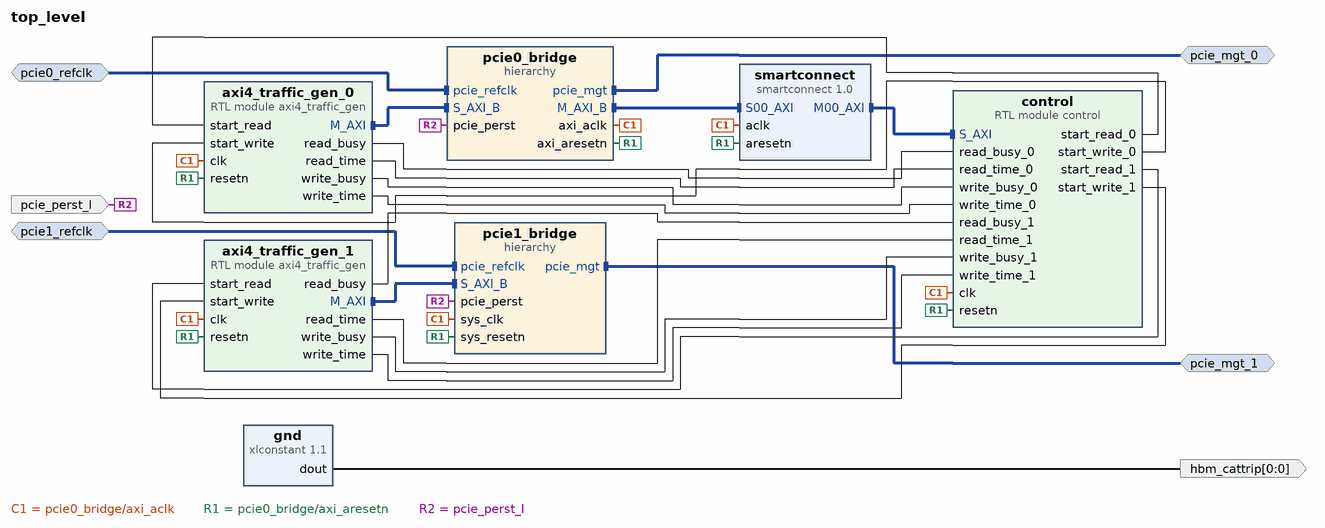
[diagram p0: block diagram of the top level]
# Vivado block design top_level, xcu55c-fsvh2892-2L-e, Vivado 2021.1
create_bd_design top_level

create_bd_intf_port -mode Slave -vlnv xilinx.com:interface:diff_clock_rtl:1.0 pcie0_refclk
create_bd_intf_port -mode Master -vlnv xilinx.com:interface:pcie_7x_mgt_rtl:1.0 pcie_mgt_0
create_bd_intf_port -mode Slave -vlnv xilinx.com:interface:diff_clock_rtl:1.0 pcie1_refclk
create_bd_intf_port -mode Master -vlnv xilinx.com:interface:pcie_7x_mgt_rtl:1.0 pcie_mgt_1
create_bd_port -dir O -from 0 -to 0 hbm_cattrip
create_bd_port -dir I -type rst pcie_perst_l

create_bd_cell -type hier pcie0_bridge
create_bd_cell -type ip -vlnv xilinx.com:ip:smartconnect:1.0 smartconnect
set_property -dict {CONFIG.NUM_SI 1} [get_bd_cells smartconnect]
create_bd_cell -type ip -vlnv xilinx.com:ip:xlconstant:1.1 gnd
set_property -dict {CONFIG.CONST_VAL 0} [get_bd_cells gnd]
create_bd_cell -type module -reference control control
create_bd_cell -type module -reference axi4_traffic_gen axi4_traffic_gen_0
set_property -dict {CONFIG.PCI_BASE_ADDR 0x0000000100000000} [get_bd_cells axi4_traffic_gen_0]
create_bd_cell -type module -reference axi4_traffic_gen axi4_traffic_gen_1
set_property -dict {CONFIG.PCI_BASE_ADDR 0x0000000200000000} [get_bd_cells axi4_traffic_gen_1]
create_bd_cell -type hier pcie1_bridge

# ---- hierarchy /pcie0_bridge ----
current_bd_instance /pcie0_bridge
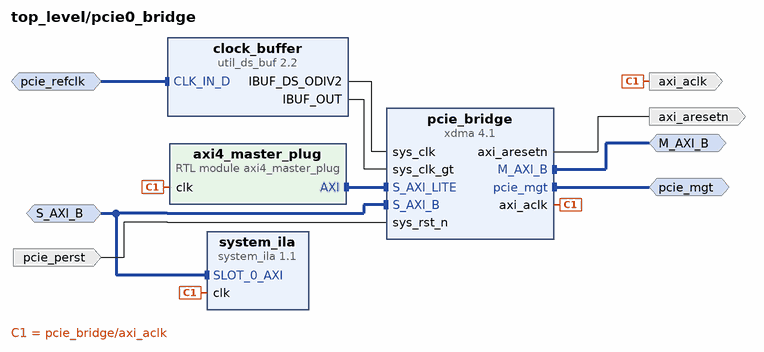
[diagram p1: block diagram inside /pcie0_bridge]
create_bd_intf_pin -mode Master -vlnv xilinx.com:interface:pcie_7x_mgt_rtl:1.0 pcie_mgt
create_bd_intf_pin -mode Slave -vlnv xilinx.com:interface:diff_clock_rtl:1.0 pcie_refclk
create_bd_intf_pin -mode Master -vlnv xilinx.com:interface:aximm_rtl:1.0 M_AXI_B
create_bd_intf_pin -mode Slave -vlnv xilinx.com:interface:aximm_rtl:1.0 S_AXI_B
create_bd_pin -dir I -type rst pcie_perst
create_bd_pin -dir O axi_aclk
create_bd_pin -dir O axi_aresetn

create_bd_cell -type ip -vlnv xilinx.com:ip:xdma:4.1 pcie_bridge
set_property -dict [list \
  CONFIG.PF0_DEVICE_ID_mqdma 9048 \
  CONFIG.PF0_SRIOV_VF_DEVICE_ID A048 \
  CONFIG.PF2_DEVICE_ID_mqdma 9248 \
  CONFIG.PF3_DEVICE_ID_mqdma 9348 \
  CONFIG.axi_addr_width 64 \
  CONFIG.axi_data_width 512_bit \
  CONFIG.axisten_freq 250 \
  CONFIG.bridge_burst true \
  CONFIG.en_axi_slave_if true \
  CONFIG.en_gt_selection true \
  CONFIG.functional_mode AXI_Bridge \
  CONFIG.mode_selection Advanced \
  CONFIG.pcie_blk_locn PCIE4C_X1Y1 \
  CONFIG.pf0_bar0_scale Megabytes \
  CONFIG.pf0_bar0_size 1 \
  CONFIG.pf0_device_id 903f \
  CONFIG.pf0_msi_enabled false \
  CONFIG.pl_link_cap_max_link_speed 16.0_GT/s \
  CONFIG.pl_link_cap_max_link_width X8 \
  CONFIG.select_quad GTY_Quad_227 \
] [get_bd_cells pcie_bridge]
create_bd_cell -type ip -vlnv xilinx.com:ip:util_ds_buf:2.2 clock_buffer
set_property -dict {CONFIG.C_BUF_TYPE IBUFDSGTE} [get_bd_cells clock_buffer]
create_bd_cell -type ip -vlnv xilinx.com:ip:system_ila:1.1 system_ila
create_bd_cell -type module -reference axi4_master_plug axi4_master_plug

# ---- hierarchy /pcie1_bridge ----
current_bd_instance /pcie1_bridge
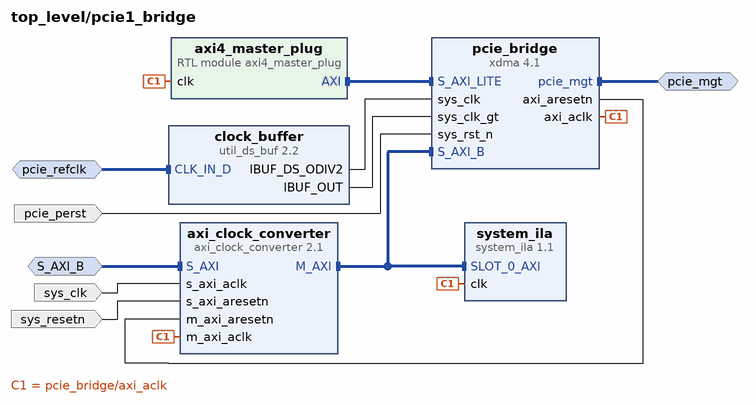
[diagram p2: block diagram inside /pcie1_bridge]
create_bd_intf_pin -mode Master -vlnv xilinx.com:interface:pcie_7x_mgt_rtl:1.0 pcie_mgt
create_bd_intf_pin -mode Slave -vlnv xilinx.com:interface:diff_clock_rtl:1.0 pcie_refclk
create_bd_intf_pin -mode Slave -vlnv xilinx.com:interface:aximm_rtl:1.0 S_AXI_B
create_bd_pin -dir I -type rst pcie_perst
create_bd_pin -dir I sys_clk
create_bd_pin -dir I sys_resetn

create_bd_cell -type ip -vlnv xilinx.com:ip:xdma:4.1 pcie_bridge
set_property -dict [list \
  CONFIG.PF0_DEVICE_ID_mqdma 9048 \
  CONFIG.PF0_SRIOV_VF_DEVICE_ID A048 \
  CONFIG.PF2_DEVICE_ID_mqdma 9248 \
  CONFIG.PF3_DEVICE_ID_mqdma 9348 \
  CONFIG.axi_addr_width 64 \
  CONFIG.axi_data_width 512_bit \
  CONFIG.axisten_freq 250 \
  CONFIG.bridge_burst true \
  CONFIG.en_axi_master_if false \
  CONFIG.en_axi_slave_if true \
  CONFIG.en_gt_selection true \
  CONFIG.functional_mode AXI_Bridge \
  CONFIG.mode_selection Advanced \
  CONFIG.pcie_blk_locn PCIE4C_X1Y0 \
  CONFIG.pf0_bar0_scale Megabytes \
  CONFIG.pf0_bar0_size 1 \
  CONFIG.pf0_device_id 9040 \
  CONFIG.pf0_msi_enabled false \
  CONFIG.pl_link_cap_max_link_speed 16.0_GT/s \
  CONFIG.pl_link_cap_max_link_width X8 \
  CONFIG.select_quad GTY_Quad_225 \
] [get_bd_cells pcie_bridge]
create_bd_cell -type ip -vlnv xilinx.com:ip:util_ds_buf:2.2 clock_buffer
set_property -dict {CONFIG.C_BUF_TYPE IBUFDSGTE} [get_bd_cells clock_buffer]
create_bd_cell -type ip -vlnv xilinx.com:ip:system_ila:1.1 system_ila
create_bd_cell -type ip -vlnv xilinx.com:ip:axi_clock_converter:2.1 axi_clock_converter
create_bd_cell -type module -reference axi4_master_plug axi4_master_plug

# ---- connections ----

current_bd_instance /pcie0_bridge
connect_bd_intf_net [get_bd_intf_pins pcie_refclk] [get_bd_intf_pins clock_buffer/CLK_IN_D]
connect_bd_intf_net [get_bd_intf_pins S_AXI_B] [get_bd_intf_pins pcie_bridge/S_AXI_B]
connect_bd_intf_net [get_bd_intf_pins S_AXI_B] [get_bd_intf_pins system_ila/SLOT_0_AXI]
connect_bd_intf_net [get_bd_intf_pins axi4_master_plug/AXI] [get_bd_intf_pins pcie_bridge/S_AXI_LITE]
connect_bd_intf_net [get_bd_intf_pins M_AXI_B] [get_bd_intf_pins pcie_bridge/M_AXI_B]
connect_bd_intf_net [get_bd_intf_pins pcie_mgt] [get_bd_intf_pins pcie_bridge/pcie_mgt]
connect_bd_net -net sys_rst_n_0_1 [get_bd_pins pcie_perst] [get_bd_pins pcie_bridge/sys_rst_n]
connect_bd_net -net util_ds_buf_0_IBUF_DS_ODIV2 [get_bd_pins clock_buffer/IBUF_DS_ODIV2] [get_bd_pins pcie_bridge/sys_clk]
connect_bd_net -net util_ds_buf_0_IBUF_OUT [get_bd_pins clock_buffer/IBUF_OUT] [get_bd_pins pcie_bridge/sys_clk_gt]
connect_bd_net -net xdma_0_axi_aclk [get_bd_pins pcie_bridge/axi_aclk] \
  [get_bd_pins axi_aclk] [get_bd_pins system_ila/clk] [get_bd_pins axi4_master_plug/clk]
connect_bd_net -net xdma_0_axi_aresetn [get_bd_pins pcie_bridge/axi_aresetn] [get_bd_pins axi_aresetn]

current_bd_instance /pcie1_bridge
connect_bd_intf_net [get_bd_intf_pins pcie_refclk] [get_bd_intf_pins clock_buffer/CLK_IN_D]
connect_bd_intf_net [get_bd_intf_pins S_AXI_B] [get_bd_intf_pins axi_clock_converter/S_AXI]
connect_bd_intf_net [get_bd_intf_pins axi4_master_plug/AXI] [get_bd_intf_pins pcie_bridge/S_AXI_LITE]
connect_bd_intf_net [get_bd_intf_pins axi_clock_converter/M_AXI] [get_bd_intf_pins pcie_bridge/S_AXI_B]
connect_bd_intf_net [get_bd_intf_pins axi_clock_converter/M_AXI] [get_bd_intf_pins system_ila/SLOT_0_AXI]
connect_bd_intf_net [get_bd_intf_pins pcie_mgt] [get_bd_intf_pins pcie_bridge/pcie_mgt]
connect_bd_net [get_bd_pins pcie_bridge/axi_aresetn] [get_bd_pins axi_clock_converter/m_axi_aresetn]
connect_bd_net [get_bd_pins sys_clk] [get_bd_pins axi_clock_converter/s_axi_aclk]
connect_bd_net [get_bd_pins sys_resetn] [get_bd_pins axi_clock_converter/s_axi_aresetn]
connect_bd_net -net sys_rst_n_0_1 [get_bd_pins pcie_perst] [get_bd_pins pcie_bridge/sys_rst_n]
connect_bd_net -net util_ds_buf_0_IBUF_DS_ODIV2 [get_bd_pins clock_buffer/IBUF_DS_ODIV2] [get_bd_pins pcie_bridge/sys_clk]
connect_bd_net -net util_ds_buf_0_IBUF_OUT [get_bd_pins clock_buffer/IBUF_OUT] [get_bd_pins pcie_bridge/sys_clk_gt]
connect_bd_net -net xdma_0_axi_aclk [get_bd_pins pcie_bridge/axi_aclk] \
  [get_bd_pins system_ila/clk] [get_bd_pins axi_clock_converter/m_axi_aclk] [get_bd_pins axi4_master_plug/clk]

current_bd_instance /
connect_bd_intf_net [get_bd_intf_ports pcie0_refclk] [get_bd_intf_pins pcie0_bridge/pcie_refclk]
connect_bd_intf_net [get_bd_intf_ports pcie1_refclk] [get_bd_intf_pins pcie1_bridge/pcie_refclk]
connect_bd_intf_net [get_bd_intf_pins pcie1_bridge/S_AXI_B] [get_bd_intf_pins axi4_traffic_gen_1/M_AXI]
connect_bd_intf_net [get_bd_intf_pins axi4_traffic_gen_0/M_AXI] [get_bd_intf_pins pcie0_bridge/S_AXI_B]
connect_bd_intf_net [get_bd_intf_ports pcie_mgt_1] [get_bd_intf_pins pcie1_bridge/pcie_mgt]
connect_bd_intf_net [get_bd_intf_pins pcie0_bridge/M_AXI_B] [get_bd_intf_pins smartconnect/S00_AXI]
connect_bd_intf_net [get_bd_intf_pins control/S_AXI] [get_bd_intf_pins smartconnect/M00_AXI]
connect_bd_intf_net [get_bd_intf_ports pcie_mgt_0] [get_bd_intf_pins pcie0_bridge/pcie_mgt]
connect_bd_net [get_bd_pins axi4_traffic_gen_0/read_busy] [get_bd_pins control/read_busy_0]
connect_bd_net [get_bd_pins axi4_traffic_gen_0/read_time] [get_bd_pins control/read_time_0]
connect_bd_net [get_bd_pins axi4_traffic_gen_0/write_busy] [get_bd_pins control/write_busy_0]
connect_bd_net [get_bd_pins axi4_traffic_gen_0/write_time] [get_bd_pins control/write_time_0]
connect_bd_net [get_bd_pins axi4_traffic_gen_1/read_busy] [get_bd_pins control/read_busy_1]
connect_bd_net [get_bd_pins axi4_traffic_gen_1/read_time] [get_bd_pins control/read_time_1]
connect_bd_net [get_bd_pins axi4_traffic_gen_1/write_busy] [get_bd_pins control/write_busy_1]
connect_bd_net [get_bd_pins axi4_traffic_gen_1/write_time] [get_bd_pins control/write_time_1]
connect_bd_net [get_bd_pins control/start_read_0] [get_bd_pins axi4_traffic_gen_0/start_read]
connect_bd_net [get_bd_pins control/start_read_1] [get_bd_pins axi4_traffic_gen_1/start_read]
connect_bd_net [get_bd_pins control/start_write_0] [get_bd_pins axi4_traffic_gen_0/start_write]
connect_bd_net [get_bd_pins control/start_write_1] [get_bd_pins axi4_traffic_gen_1/start_write]
connect_bd_net [get_bd_pins gnd/dout] [get_bd_ports hbm_cattrip]
connect_bd_net -net pcie_bridge_0_axi_aclk [get_bd_pins pcie0_bridge/axi_aclk] \
  [get_bd_pins smartconnect/aclk] [get_bd_pins control/clk] [get_bd_pins axi4_traffic_gen_0/clk] \
  [get_bd_pins axi4_traffic_gen_1/clk] [get_bd_pins pcie1_bridge/sys_clk]
connect_bd_net -net pcie_bridge_0_axi_aresetn [get_bd_pins pcie0_bridge/axi_aresetn] \
  [get_bd_pins smartconnect/aresetn] [get_bd_pins control/resetn] [get_bd_pins axi4_traffic_gen_0/resetn] \
  [get_bd_pins axi4_traffic_gen_1/resetn] [get_bd_pins pcie1_bridge/sys_resetn]
connect_bd_net -net sys_rst_n_0_1 [get_bd_ports pcie_perst_l] [get_bd_pins pcie0_bridge/pcie_perst] [get_bd_pins pcie1_bridge/pcie_perst]

# ---- address map ----
assign_bd_address -offset 0x0000000000000000 -range 16E -target_address_space [get_bd_addr_spaces axi4_traffic_gen_0/M_AXI] [get_bd_addr_segs pcie0_bridge/pcie_bridge/S_AXI_B/BAR0]
assign_bd_address -offset 0x0000000000000000 -range 16E -target_address_space [get_bd_addr_spaces axi4_traffic_gen_1/M_AXI] [get_bd_addr_segs pcie1_bridge/pcie_bridge/S_AXI_B/BAR0]
assign_bd_address -offset 0x00000000 -range 512M -target_address_space [get_bd_addr_spaces pcie0_bridge/axi4_master_plug/AXI] [get_bd_addr_segs pcie0_bridge/pcie_bridge/S_AXI_LITE/CTL0]
assign_bd_address -offset 0x0000000000001000 -range 256 -target_address_space [get_bd_addr_spaces pcie0_bridge/pcie_bridge/M_AXI_B] [get_bd_addr_segs control/S_AXI/reg0]
assign_bd_address -offset 0x00000000 -range 512M -target_address_space [get_bd_addr_spaces pcie1_bridge/axi4_master_plug/AXI] [get_bd_addr_segs pcie1_bridge/pcie_bridge/S_AXI_LITE/CTL0]

validate_bd_design
save_bd_design
